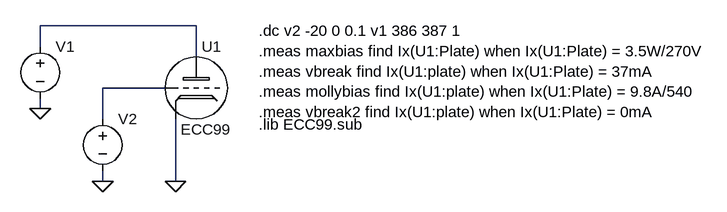
[diagram p0: schematic ECC99m.asc]
ECC99m.asc, the LTspice schematic file:
Version 4
SHEET 1 1284 680
WIRE 496 208 256 208
WIRE 256 240 256 208
WIRE 496 256 496 208
WIRE 448 304 352 304
WIRE 256 336 256 320
WIRE 352 352 352 304
WIRE 352 448 352 432
WIRE 464 448 464 352
FLAG 256 336 0
FLAG 464 448 0
FLAG 352 448 0
SYMBOL voltage 256 224 R0
WINDOW 3 24 38 Left 2
SYMATTR Value ""
SYMATTR InstName V1
SYMBOL voltage 352 336 R0
SYMATTR InstName V2
SYMATTR Value ""
SYMBOL ECC99 496 304 R0
SYMATTR InstName U1
TEXT 592 360 Left 2 !.lib ECC99.sub
TEXT 592 216 Left 2 !.dc v2 -20 0 0.1 v1 386 387 1\n.meas maxbias find Ix(U1:Plate) when Ix(U1:Plate) = 3.5W/270V\n.meas vbreak find Ix(U1:plate) when Ix(U1:Plate) = 37mA\n.meas mollybias find Ix(U1:plate) when Ix(U1:Plate) = 9.8A/540\n.meas vbreak2 find Ix(U1:plate) when Ix(U1:Plate) = 0mA

The netlist it stands for:
* ECC99m.asc
V1 N001 0
V2 N002 0
XU1 N001 N002 0 ECC99  ; pins Plate Grid Cathode
.lib ECC99.sub
.dc v2 -20 0 0.1 v1 386 387 1
.meas maxbias find Ix(U1:Plate) when Ix(U1:Plate) = 3.5W/270V
.meas vbreak find Ix(U1:plate) when Ix(U1:Plate) = 37mA
.meas mollybias find Ix(U1:plate) when Ix(U1:Plate) = 9.8A/540
.meas vbreak2 find Ix(U1:plate) when Ix(U1:Plate) = 0mA
.lib ECC99.sub
.backanno
.end